# EAGLE design 4WireTouch (EAGLE 7.2.0)
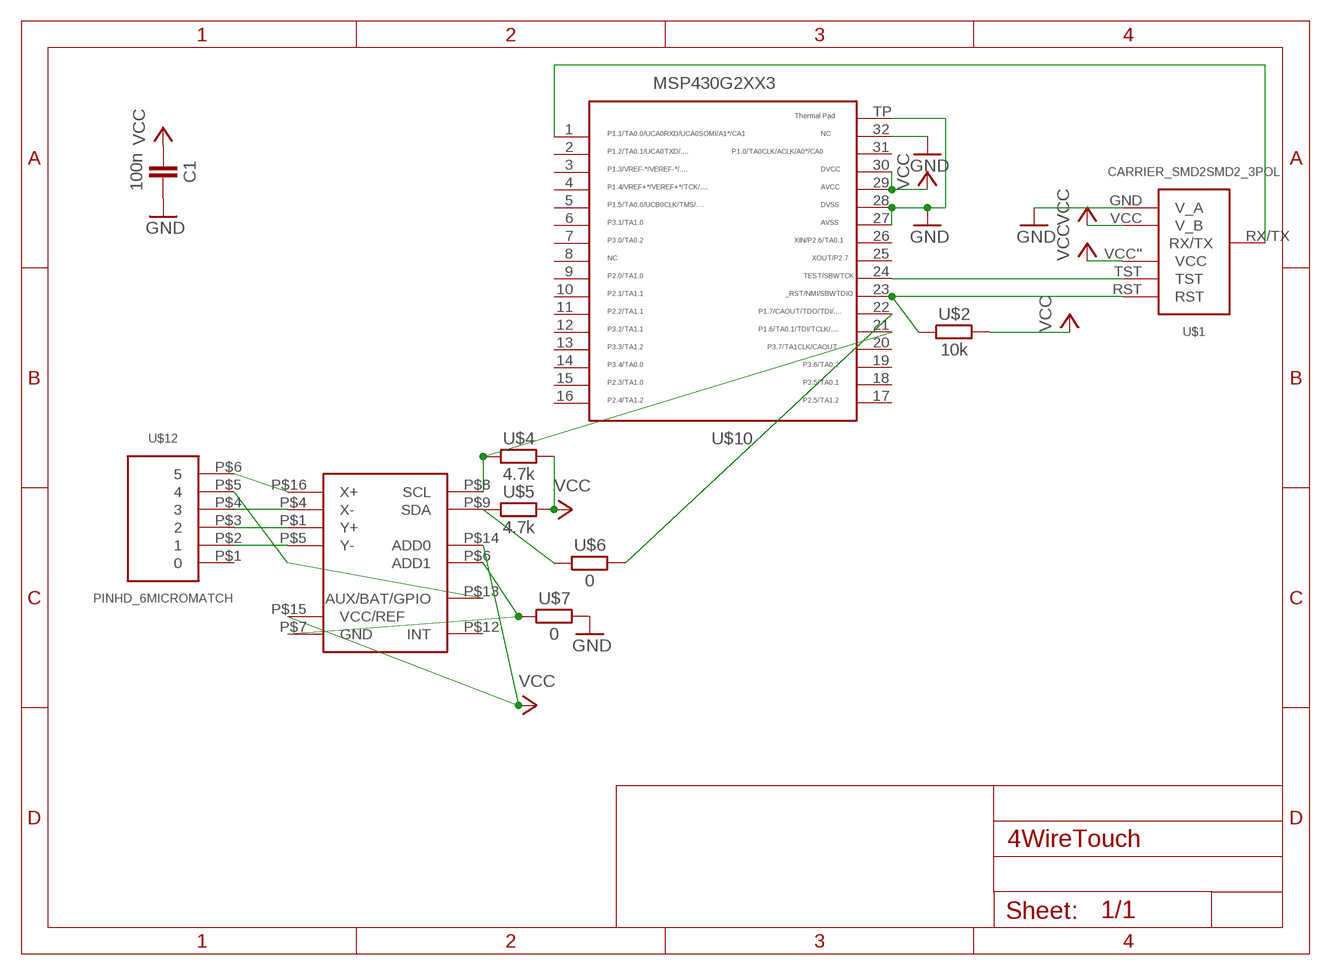
[diagram p0: schematic, sheet 1]

## Parts
C1  100n  CAPACITOR  [603]
U$1  CARRIER_SMD2SMD2_3POL  [CARRIER_SMD2_3POL]
U$2  10k  RESISTOR0603  [603]
U$3  AD7879  [LFCSP]
U$4  4.7k  RESISTOR0603  [603]
U$5  4.7k  RESISTOR0603  [603]
U$6  0  RESISTOR0603  [603]
U$7  0  RESISTOR0603  [603]
U$10  MSP430G2553  [QFN32]
U$12  PINHD_6MICROMATCH  [MICROMATCH6POL]

## Nets
GND: C1.2 U$1.GND(V_A) U$7.2 U$10.27 U$10.28 U$10.32 U$10.TP
N$2: U$3.P$8(SCL) U$4.1 U$10.21
N$3: U$1.TST U$10.24
N$4: U$1.RST U$2.1 U$10.23
N$5: U$3.P$9(SDA) U$5.1 U$6.1
N$6: U$3.P$13(AUX/BAT/GPIO) U$12.P$5
N$7: U$3.P$5(Y-) U$12.P$2
N$11: U$3.P$4(X-) U$12.P$4
N$12: U$1.RX/TX U$10.1
N$13: U$3.P$1(Y+) U$12.P$3
N$14: U$3.P$16(X+) U$12.P$6
N$15: U$6.2 U$10.22
N$16: U$3.P$6(ADD1) U$3.P$7(GND) U$7.1
VCC: C1.1 U$1.VCC''(VCC) U$1.VCC(V_B) U$2.2 U$3.P$14(ADD0) U$3.P$15(VCC/REF) U$4.2 U$5.2 U$10.29 U$10.30
Unconnected: U$3.P$12(INT) U$10.2 U$10.3 U$10.4 U$10.5 U$10.6 U$10.7 U$10.8 U$10.9 U$10.10 U$10.11 U$10.12 U$10.13 U$10.14 U$10.15 U$10.16 U$10.17 U$10.18 U$10.19 U$10.20 U$10.25 U$10.26 U$10.31 U$12.P$1

## Library data of the parts
C1 = thar:CAPACITOR
U$1 = thar:CARRIER_SMD2
U$2 U$4-U$7 = thar:RESISTOR
U$3 = thar:AD7879
U$10 = thar:MSP430G2553: TEXAS INSTRUMENTS MSP430G2553IRHB32R MCU, 16BIT, MSP430, 16MHZ, QFN-32 Farnell Best.Nr.: 2325726 Herst.Bez.: MSP430G2553IRHB32R
U$12 = thar:PINHD_6

## Board
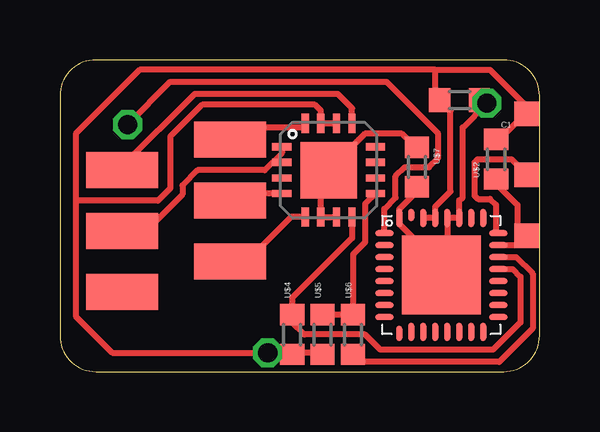
[diagram p1: board, top side]
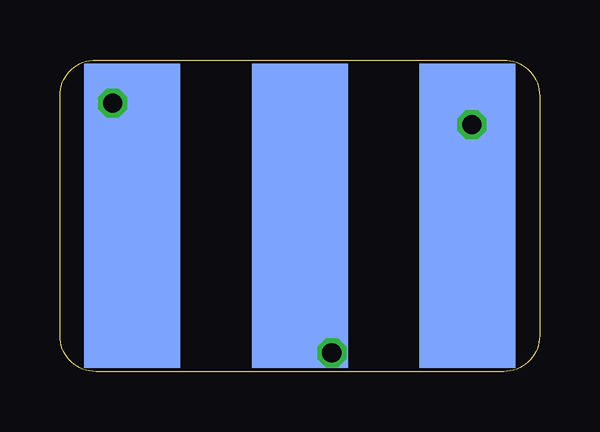
[diagram p2: board, bottom side, seen from below]

Size 20 x 13 mm. Coordinates in mm from the lower left corner, seen from the top.
Copper layers (1*16): Top 0.035mm / dielectric 1.5mm / Bottom 0.035mm
Design rules "Bilex DRU *": minimum track width 10mil, minimum drill 24mil, track to track 10mil, track to pad 10mil, pad to pad 10mil, via to via 10mil, smd to smd 10mil, copper to edge 1mil, drill to drill 8mil, minimum pad ring 10mil, minimum via ring 8mil, stop-mask expansion 4mil, vias tented up to drill 0mil, thermal gap 10mil

### Footprints (pad centres in the part's own frame; a part is rotated, then mirrored left to right if it is on the bottom)
603 = smd 0.889 x 1.016: 1 -0.826,0; 2 0.826,0
CARRIER_SMD2_3POL = smd 4 x 12.7 bottom: GND -6.985,0; RX/TX 6.985,0; VCC 0,0 | smd 1.016 x 1.016: RST -9.461,0.826; TST -9.461,-1.714; VCC'' -9.461,-4.255
LFCSP = smd 0.8 x 0.3: P$1 -1.95,0.975; P$2 -1.95,0.325; P$3 -1.95,-0.325; P$4 -1.95,-0.975; P$9 1.95,-0.975; P$10 1.95,-0.325; P$11 1.95,0.325; P$12 1.95,0.975 | smd 0.3 x 0.8: P$5 -0.975,-1.95; P$6 -0.325,-1.95; P$7 0.325,-1.95; P$8 0.975,-1.95; P$13 0.975,1.95; P$14 0.325,1.95; P$15 -0.325,1.95; P$16 -0.975,1.95 | smd 2.35 x 2.35: P$17 0,0
QFN32 = smd 0.762 x 0.254: 1 -2.375,1.75; 2 -2.375,1.25; 3 -2.375,0.75; 4 -2.375,0.25; 5 -2.375,-0.25; 6 -2.375,-0.75; 7 -2.375,-1.25; 8 -2.375,-1.75; 17 2.375,-1.75; 18 2.375,-1.25; 19 2.375,-0.75; 20 2.375,-0.25; 21 2.375,0.25; 22 2.375,0.75; 23 2.375,1.25; 24 2.375,1.75 | smd 0.254 x 0.635: 9 -1.75,-2.438 | smd 0.254 x 0.762: 10 -1.25,-2.375; 11 -0.75,-2.375; 12 -0.25,-2.375; 13 0.25,-2.375; 14 0.75,-2.375; 15 1.25,-2.375; 16 1.75,-2.375; 25 1.75,2.375; 26 1.25,2.375; 27 0.75,2.375; 28 0.25,2.375; 29 -0.25,2.375; 30 -0.75,2.375; 32 -1.75,2.375 | smd 0.254 x 0.508: 31 -1.25,2.5 | smd 3.302 x 3.302: TP 0,0
MICROMATCH6POL = smd 1.5 x 3: P$1 -3.175,2.25; P$2 -1.905,-2.25; P$3 -0.635,2.25; P$4 0.635,-2.25; P$5 1.905,2.25; P$6 3.175,-2.25

### Placement (x,y rotation side)
C1  16.66,11.32 0 top
U$1  10,6.5 180 top
U$2  18.19,8.86 90 top
U$3  11.2,8.4 0 top
U$4  9.68,1.54 270 top
U$5  10.95,1.54 270 top
U$6  12.22,1.54 270 top
U$7  14.89,8.53 270 top
U$10  15.9,4.03 0 top
U$12  4.85,6.5 90 top

### Tracks (layer width: path | path; a pad name or v marks a point on that pad's centre or on a via)
GND  (via drill 0.8)
  Top 0.254: 16.43,4.35 16.19,5.38 16.16,5.35 | 16.43,4.35 16.48,3.06 U$10.TP 15.01,2.94 14.89,3.14 | 16.15,4.72 U$10.28 U$10.27 16.65,7.14 16.79,7.26 16.79,10.18 v17.81,11.2 17.49,11.2 C1.2 | 16.15,4.72 16.15,4.42 16.43,4.35 | 16.15,4.72 15.52,5.35 14.76,5.55 14.15,6.16 U$10.32 14.15,6.78 14.89,7.51 U$7.2
  Bottom 0.254: 18,6.5 17.81,6.69 v17.81,11.2 16.98,10.37 U$1.GND
N$2
  Top 0.254: U$10.21 18.88,4.28 19.2,3.96 19.2,2.05 18.06,0.91 13.36,0.91 12.73,1.54 10.19,1.54 9.68,2.05 U$4.1 | 9.64,2.33 U$4.1 | 9.68,2.31 U$4.1 | U$4.1 9.68,3.07 12.18,5.57 U$3.P$8
N$3
  Top 0.254: 19.61,7.88 19.46,8.02 19.5,8.18 U$1.TST | U$10.24 18.19,5.78 18.19,6.95 17.93,7.21 17.43,7.21 17.3,7.33 17.3,8.73 17.43,8.86 18.82,8.86 U$1.TST | U$1.TST
N$4
  Top 0.254: 19.46,5.48 19.5,5.38 | 19.46,5.48 19.5,5.69 | 19.5,5.69 19.08,5.74 19.08,6.95 18.06,7.97 U$2.1 | U$10.23 19.28,5.28 19.46,5.48 | 19.5,5.69 19.48,5.69 U$1.RST
N$5
  Top 0.254: 11.25,2.54 U$5.1 | 10.99,2.29 U$5.1 | U$3.P$9 12.73,7.01 12.73,5.39 12.22,4.89 U$6.1 U$5.1
N$6
  Top 0.254: U$3.P$13 12.18,10.98 11.59,11.58 5.62,11.58 2.6,8.56 U$12.P$5
N$7
  Top 0.254: U$3.P$5 9.63,6.45 7.9,4.72 7.23,4.72 U$12.P$2
N$11
  Top 0.254: U$3.P$4 7.4,7.43 U$12.P$4
N$12  (via drill 0.8)
  Top 0.254: v2.82,10.31 4.6,12.09 13.62,12.09 15.78,9.93 15.78,8.91 15.39,8.53 14.38,8.53 14,8.15 14,7.26 13.53,6.79 U$10.1
  Bottom 0.254: U$1.RX/TX 3.01,11.13 v2.82,10.31
N$13
  Top 0.254: U$3.P$1 9.25,9.12 8.54,8.4 5.74,8.4 5.11,7.77 5.11,7.39 3.58,5.86 U$12.P$3 3.08,5.86
N$14
  Top 0.254: U$3.P$16 10.23,10.18 8.16,10.18 8.16,9.67 U$12.P$6
N$15
  Top 0.254: U$10.22 19.02,4.78 19.71,4.08 19.71,1.8 18.32,0.4 12.66,0.4 U$6.2
N$16
  Top 0.254: U$3.P$7 U$3.P$6 10.88,8.08 12.73,9.93 14.25,9.93 14.82,9.35 U$7.1
VCC  (via drill 0.8)
  Top 0.254: U$10.30 U$10.29 15.65,6.88 16.28,7.51 16.28,10.88 C1.1 15.65,11.32 15.65,12.59 | 19.5,10.52 19.46,10.56 | U$2.2 18.12,9.48 19.2,10.56 19.2,10.51 19.46,10.56 | 19.46,10.56 19.65,10.75 19.65,10.95 19.58,10.95 17.93,12.59 15.65,12.59 | 19.46,10.56 U$1.VCC'' | U$5.2 10.82,0.78 9.93,0.78 | 9.93,0.78 9.87,0.91 U$4.2 | U$4.2 9.93,0.78 | U$4.2 9.68,0.78 v8.66,0.78 2.19,0.78 0.66,2.31 0.66,7.13 | U$3.P$14 U$3.P$15 10.88,10.89 10.63,11.13 5.93,11.13 4.6,9.8 4.6,7.64 4.09,7.13 0.66,7.13 | 15.65,12.59 3.33,12.59 0.66,9.93 0.66,7.13
  Bottom 0.254: 10,8.28 U$1.VCC 10,1.86 9.17,1.04 8.66,0.91 v8.66,0.78 | 10,8.28 10,10.88 11.33,12.21 | 11.2,8.4 9.55,8.4 9.43,8.28 10,8.28